# Altium schematic sheet LED_Panel.SchDoc
size D; SheetNumber: 1; SheetTotal: 1
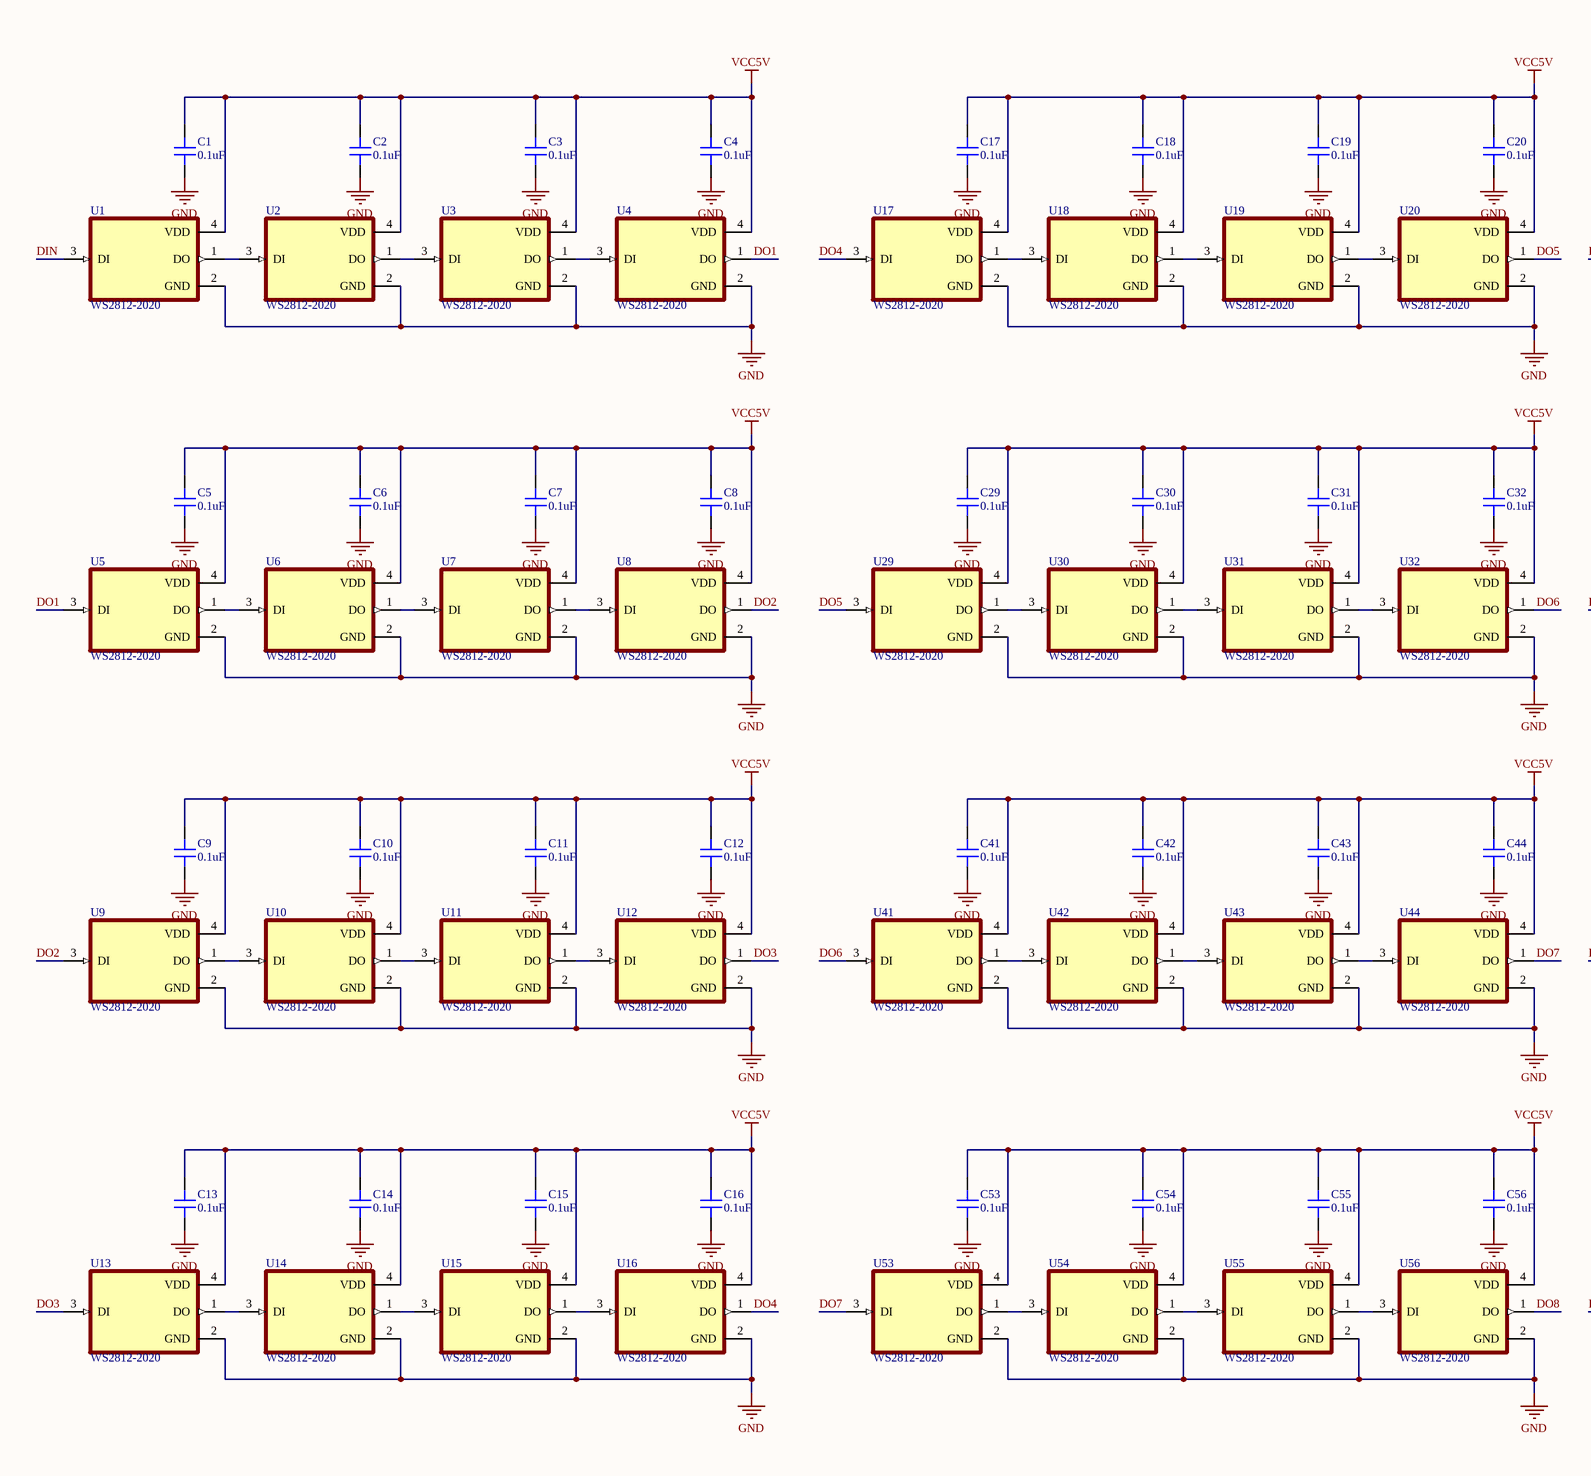
[diagram p0: LED_Panel.SchDoc, left]
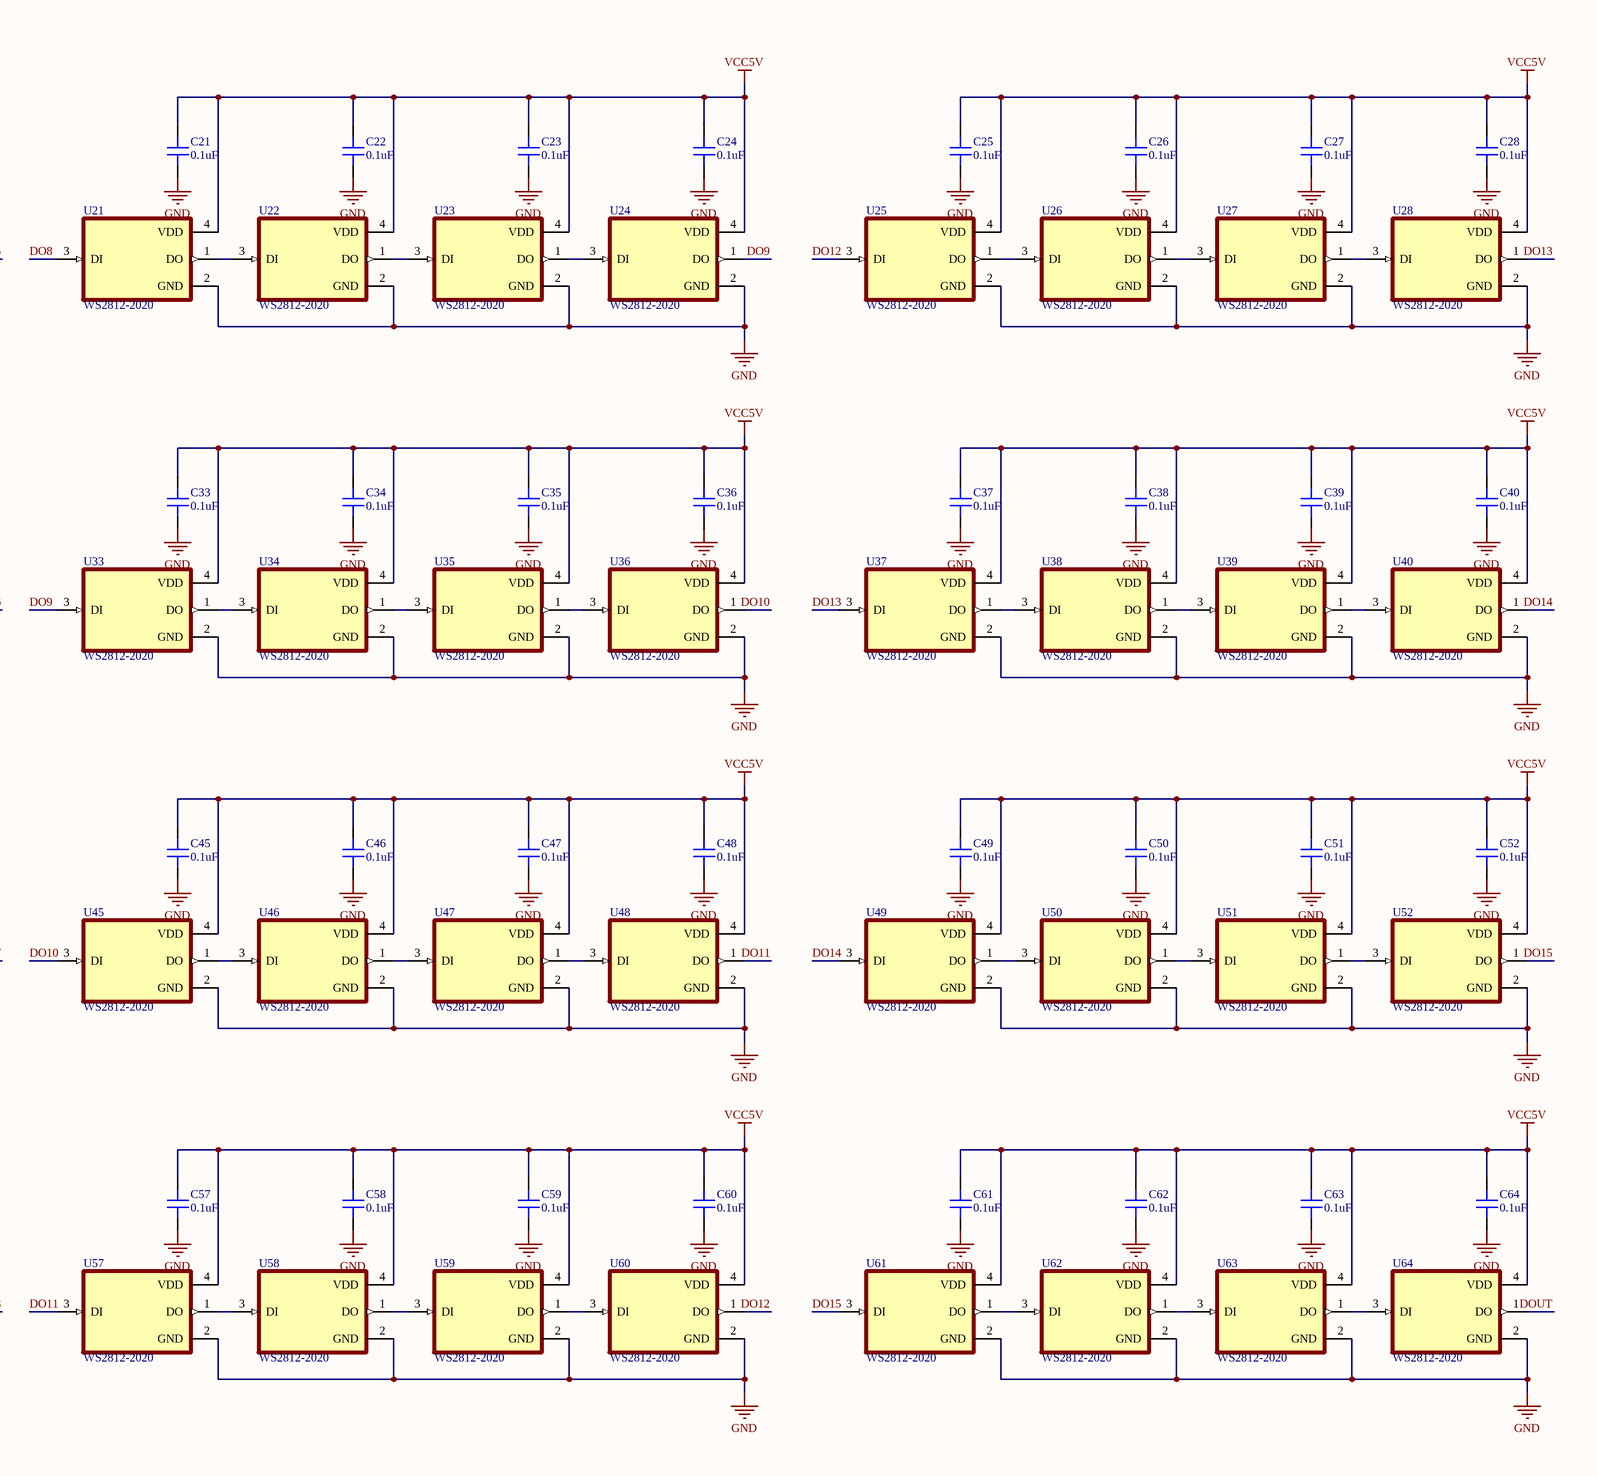
[diagram p1: LED_Panel.SchDoc, right]

## Parts
C1  0.1uF  [CAP 0603_1608]
C2  0.1uF  [CAP 0603_1608]
C3  0.1uF  [CAP 0603_1608]
C4  0.1uF  [CAP 0603_1608]
C5  0.1uF  [CAP 0603_1608]
C6  0.1uF  [CAP 0603_1608]
C7  0.1uF  [CAP 0603_1608]
C8  0.1uF  [CAP 0603_1608]
C9  0.1uF  [CAP 0603_1608]
C10  0.1uF  [CAP 0603_1608]
C11  0.1uF  [CAP 0603_1608]
C12  0.1uF  [CAP 0603_1608]
C13  0.1uF  [CAP 0603_1608]
C14  0.1uF  [CAP 0603_1608]
C15  0.1uF  [CAP 0603_1608]
C16  0.1uF  [CAP 0603_1608]
C17  0.1uF  [CAP 0603_1608]
C18  0.1uF  [CAP 0603_1608]
C19  0.1uF  [CAP 0603_1608]
C20  0.1uF  [CAP 0603_1608]
C21  0.1uF  [CAP 0603_1608]
C22  0.1uF  [CAP 0603_1608]
C23  0.1uF  [CAP 0603_1608]
C24  0.1uF  [CAP 0603_1608]
C25  0.1uF  [CAP 0603_1608]
C26  0.1uF  [CAP 0603_1608]
C27  0.1uF  [CAP 0603_1608]
C28  0.1uF  [CAP 0603_1608]
C29  0.1uF  [CAP 0603_1608]
C30  0.1uF  [CAP 0603_1608]
C31  0.1uF  [CAP 0603_1608]
C32  0.1uF  [CAP 0603_1608]
C33  0.1uF  [CAP 0603_1608]
C34  0.1uF  [CAP 0603_1608]
C35  0.1uF  [CAP 0603_1608]
C36  0.1uF  [CAP 0603_1608]
C37  0.1uF  [CAP 0603_1608]
C38  0.1uF  [CAP 0603_1608]
C39  0.1uF  [CAP 0603_1608]
C40  0.1uF  [CAP 0603_1608]
C41  0.1uF  [CAP 0603_1608]
C42  0.1uF  [CAP 0603_1608]
C43  0.1uF  [CAP 0603_1608]
C44  0.1uF  [CAP 0603_1608]
C45  0.1uF  [CAP 0603_1608]
C46  0.1uF  [CAP 0603_1608]
C47  0.1uF  [CAP 0603_1608]
C48  0.1uF  [CAP 0603_1608]
C49  0.1uF  [CAP 0603_1608]
C50  0.1uF  [CAP 0603_1608]
C51  0.1uF  [CAP 0603_1608]
C52  0.1uF  [CAP 0603_1608]
C53  0.1uF  [CAP 0603_1608]
C54  0.1uF  [CAP 0603_1608]
C55  0.1uF  [CAP 0603_1608]
C56  0.1uF  [CAP 0603_1608]
C57  0.1uF  [CAP 0603_1608]
C58  0.1uF  [CAP 0603_1608]
C59  0.1uF  [CAP 0603_1608]
C60  0.1uF  [CAP 0603_1608]
C61  0.1uF  [CAP 0603_1608]
C62  0.1uF  [CAP 0603_1608]
C63  0.1uF  [CAP 0603_1608]
C64  0.1uF  [CAP 0603_1608]
U1  WS2812-2020  [LED_WS2812-2020]
U2  WS2812-2020  [LED_WS2812-2020]
U3  WS2812-2020  [LED_WS2812-2020]
U4  WS2812-2020  [LED_WS2812-2020]
U5  WS2812-2020  [LED_WS2812-2020]
U6  WS2812-2020  [LED_WS2812-2020]
U7  WS2812-2020  [LED_WS2812-2020]
U8  WS2812-2020  [LED_WS2812-2020]
U9  WS2812-2020  [LED_WS2812-2020]
U10  WS2812-2020  [LED_WS2812-2020]
U11  WS2812-2020  [LED_WS2812-2020]
U12  WS2812-2020  [LED_WS2812-2020]
U13  WS2812-2020  [LED_WS2812-2020]
U14  WS2812-2020  [LED_WS2812-2020]
U15  WS2812-2020  [LED_WS2812-2020]
U16  WS2812-2020  [LED_WS2812-2020]
U17  WS2812-2020  [LED_WS2812-2020]
U18  WS2812-2020  [LED_WS2812-2020]
U19  WS2812-2020  [LED_WS2812-2020]
U20  WS2812-2020  [LED_WS2812-2020]
U21  WS2812-2020  [LED_WS2812-2020]
U22  WS2812-2020  [LED_WS2812-2020]
U23  WS2812-2020  [LED_WS2812-2020]
U24  WS2812-2020  [LED_WS2812-2020]
U25  WS2812-2020  [LED_WS2812-2020]
U26  WS2812-2020  [LED_WS2812-2020]
U27  WS2812-2020  [LED_WS2812-2020]
U28  WS2812-2020  [LED_WS2812-2020]
U29  WS2812-2020  [LED_WS2812-2020]
U30  WS2812-2020  [LED_WS2812-2020]
U31  WS2812-2020  [LED_WS2812-2020]
U32  WS2812-2020  [LED_WS2812-2020]
U33  WS2812-2020  [LED_WS2812-2020]
U34  WS2812-2020  [LED_WS2812-2020]
U35  WS2812-2020  [LED_WS2812-2020]
U36  WS2812-2020  [LED_WS2812-2020]
U37  WS2812-2020  [LED_WS2812-2020]
U38  WS2812-2020  [LED_WS2812-2020]
U39  WS2812-2020  [LED_WS2812-2020]
U40  WS2812-2020  [LED_WS2812-2020]
U41  WS2812-2020  [LED_WS2812-2020]
U42  WS2812-2020  [LED_WS2812-2020]
U43  WS2812-2020  [LED_WS2812-2020]
U44  WS2812-2020  [LED_WS2812-2020]
U45  WS2812-2020  [LED_WS2812-2020]
U46  WS2812-2020  [LED_WS2812-2020]
U47  WS2812-2020  [LED_WS2812-2020]
U48  WS2812-2020  [LED_WS2812-2020]
U49  WS2812-2020  [LED_WS2812-2020]
U50  WS2812-2020  [LED_WS2812-2020]
U51  WS2812-2020  [LED_WS2812-2020]
U52  WS2812-2020  [LED_WS2812-2020]
U53  WS2812-2020  [LED_WS2812-2020]
U54  WS2812-2020  [LED_WS2812-2020]
U55  WS2812-2020  [LED_WS2812-2020]
U56  WS2812-2020  [LED_WS2812-2020]
U57  WS2812-2020  [LED_WS2812-2020]
U58  WS2812-2020  [LED_WS2812-2020]
U59  WS2812-2020  [LED_WS2812-2020]
U60  WS2812-2020  [LED_WS2812-2020]
U61  WS2812-2020  [LED_WS2812-2020]
U62  WS2812-2020  [LED_WS2812-2020]
U63  WS2812-2020  [LED_WS2812-2020]
U64  WS2812-2020  [LED_WS2812-2020]

## Nets
GND: C1.1 C2.1 C3.1 C4.1 C5.1 C6.1 C7.1 C8.1 C9.1 C10.1 C11.1 C12.1 C13.1 C14.1 C15.1 C16.1 C17.1 C18.1 C19.1 C20.1 C21.1 C22.1 C23.1 C24.1 C25.1 C26.1 C27.1 C28.1 C29.1 C30.1 C31.1 C32.1 C33.1 C34.1 C35.1 C36.1 C37.1 C38.1 C39.1 C40.1 C41.1 C42.1 C43.1 C44.1 C45.1 C46.1 C47.1 C48.1 C49.1 C50.1 C51.1 C52.1 C53.1 C54.1 C55.1 C56.1 C57.1 C58.1 C59.1 C60.1 C61.1 C62.1 C63.1 C64.1 U1.2(GND) U2.2(GND) U3.2(GND) U4.2(GND) U5.2(GND) U6.2(GND) U7.2(GND) U8.2(GND) U9.2(GND) U10.2(GND) U11.2(GND) U12.2(GND) U13.2(GND) U14.2(GND) U15.2(GND) U16.2(GND) U17.2(GND) U18.2(GND) U19.2(GND) U20.2(GND) U21.2(GND) U22.2(GND) U23.2(GND) U24.2(GND) U25.2(GND) U26.2(GND) U27.2(GND) U28.2(GND) U29.2(GND) U30.2(GND) U31.2(GND) U32.2(GND) U33.2(GND) U34.2(GND) U35.2(GND) U36.2(GND) U37.2(GND) U38.2(GND) U39.2(GND) U40.2(GND) U41.2(GND) U42.2(GND) U43.2(GND) U44.2(GND) U45.2(GND) U46.2(GND) U47.2(GND) U48.2(GND) U49.2(GND) U50.2(GND) U51.2(GND) U52.2(GND) U53.2(GND) U54.2(GND) U55.2(GND) U56.2(GND) U57.2(GND) U58.2(GND) U59.2(GND) U60.2(GND) U61.2(GND) U62.2(GND) U63.2(GND) U64.2(GND)
VCC5V: C1.2 C2.2 C3.2 C4.2 C5.2 C6.2 C7.2 C8.2 C9.2 C10.2 C11.2 C12.2 C13.2 C14.2 C15.2 C16.2 C17.2 C18.2 C19.2 C20.2 C21.2 C22.2 C23.2 C24.2 C25.2 C26.2 C27.2 C28.2 C29.2 C30.2 C31.2 C32.2 C33.2 C34.2 C35.2 C36.2 C37.2 C38.2 C39.2 C40.2 C41.2 C42.2 C43.2 C44.2 C45.2 C46.2 C47.2 C48.2 C49.2 C50.2 C51.2 C52.2 C53.2 C54.2 C55.2 C56.2 C57.2 C58.2 C59.2 C60.2 C61.2 C62.2 C63.2 C64.2 U1.4(VDD) U2.4(VDD) U3.4(VDD) U4.4(VDD) U5.4(VDD) U6.4(VDD) U7.4(VDD) U8.4(VDD) U9.4(VDD) U10.4(VDD) U11.4(VDD) U12.4(VDD) U13.4(VDD) U14.4(VDD) U15.4(VDD) U16.4(VDD) U17.4(VDD) U18.4(VDD) U19.4(VDD) U20.4(VDD) U21.4(VDD) U22.4(VDD) U23.4(VDD) U24.4(VDD) U25.4(VDD) U26.4(VDD) U27.4(VDD) U28.4(VDD) U29.4(VDD) U30.4(VDD) U31.4(VDD) U32.4(VDD) U33.4(VDD) U34.4(VDD) U35.4(VDD) U36.4(VDD) U37.4(VDD) U38.4(VDD) U39.4(VDD) U40.4(VDD) U41.4(VDD) U42.4(VDD) U43.4(VDD) U44.4(VDD) U45.4(VDD) U46.4(VDD) U47.4(VDD) U48.4(VDD) U49.4(VDD) U50.4(VDD) U51.4(VDD) U52.4(VDD) U53.4(VDD) U54.4(VDD) U55.4(VDD) U56.4(VDD) U57.4(VDD) U58.4(VDD) U59.4(VDD) U60.4(VDD) U61.4(VDD) U62.4(VDD) U63.4(VDD) U64.4(VDD)
DIN: U1.3(DI)
DO1: U4.1(DO) U5.3(DI)
DO2: U8.1(DO) U9.3(DI)
DO3: U12.1(DO) U13.3(DI)
DO4: U16.1(DO) U17.3(DI)
DO5: U20.1(DO) U29.3(DI)
DO6: U32.1(DO) U41.3(DI)
DO7: U44.1(DO) U53.3(DI)
DO8: U21.3(DI) U56.1(DO)
DO9: U24.1(DO) U33.3(DI)
DO10: U36.1(DO) U45.3(DI)
DO11: U48.1(DO) U57.3(DI)
DO12: U25.3(DI) U60.1(DO)
DO13: U28.1(DO) U37.3(DI)
DO14: U40.1(DO) U49.3(DI)
DO15: U52.1(DO) U61.3(DI)
DOUT: U64.1(DO)
NetU1_1: U1.1(DO) U2.3(DI)
NetU2_1: U2.1(DO) U3.3(DI)
NetU3_1: U3.1(DO) U4.3(DI)
NetU5_1: U5.1(DO) U6.3(DI)
NetU6_1: U6.1(DO) U7.3(DI)
NetU7_1: U7.1(DO) U8.3(DI)
NetU9_1: U9.1(DO) U10.3(DI)
NetU10_1: U10.1(DO) U11.3(DI)
NetU11_1: U11.1(DO) U12.3(DI)
NetU13_1: U13.1(DO) U14.3(DI)
NetU14_1: U14.1(DO) U15.3(DI)
NetU15_1: U15.1(DO) U16.3(DI)
NetU17_1: U17.1(DO) U18.3(DI)
NetU18_1: U18.1(DO) U19.3(DI)
NetU19_1: U19.1(DO) U20.3(DI)
NetU21_1: U21.1(DO) U22.3(DI)
NetU22_1: U22.1(DO) U23.3(DI)
NetU23_1: U23.1(DO) U24.3(DI)
NetU25_1: U25.1(DO) U26.3(DI)
NetU26_1: U26.1(DO) U27.3(DI)
NetU27_1: U27.1(DO) U28.3(DI)
NetU29_1: U29.1(DO) U30.3(DI)
NetU30_1: U30.1(DO) U31.3(DI)
NetU31_1: U31.1(DO) U32.3(DI)
NetU33_1: U33.1(DO) U34.3(DI)
NetU34_1: U34.1(DO) U35.3(DI)
NetU35_1: U35.1(DO) U36.3(DI)
NetU37_1: U37.1(DO) U38.3(DI)
NetU38_1: U38.1(DO) U39.3(DI)
NetU39_1: U39.1(DO) U40.3(DI)
NetU41_1: U41.1(DO) U42.3(DI)
NetU42_1: U42.1(DO) U43.3(DI)
NetU43_1: U43.1(DO) U44.3(DI)
NetU45_1: U45.1(DO) U46.3(DI)
NetU46_1: U46.1(DO) U47.3(DI)
NetU47_1: U47.1(DO) U48.3(DI)
NetU49_1: U49.1(DO) U50.3(DI)
NetU50_1: U50.1(DO) U51.3(DI)
NetU51_1: U51.1(DO) U52.3(DI)
NetU53_1: U53.1(DO) U54.3(DI)
NetU54_1: U54.1(DO) U55.3(DI)
NetU55_1: U55.1(DO) U56.3(DI)
NetU57_1: U57.1(DO) U58.3(DI)
NetU58_1: U58.1(DO) U59.3(DI)
NetU59_1: U59.1(DO) U60.3(DI)
NetU61_1: U61.1(DO) U62.3(DI)
NetU62_1: U62.1(DO) U63.3(DI)
NetU63_1: U63.1(DO) U64.3(DI)

## Library data of the parts
C1-C64 = C0603C272F3GAC7867: CAP CER 2700PF 25V NP0 0603; manufacturer: KEMET; Temperature Coefficient: C0G, NP0; Tolerance: ±1%; Part Number: C0603C272F3GAC7867; Value: 0.1uF; Applications: General Purpose; Capacitance: 2700 pF; componentlink1description: Datasheet; componentlink1url: https://api.kemet.com/component-edge/download/datasheet/C0603C272F3GACTU.pdf; componentlink2description: DigiKey Link; componentlink2url: https://www.digikey.com/en/products/detail/kemet/C0603C272F3GAC7867/2200413; Device Package: 0603 (1608 Metric); Features: Low ESL; lastupdated: 2022/5/23 下午 12:55:07; Lifecycle Status: Active; Minimum Order: 1; Mounting Type: Surface Mount, MLCC; Operating Temperature: -55°C ~ 125°C; Package / Case: 0603 (1608 Metric); packaging: TapeAndReel; partid: 2138; Part Status: Active; price: 0.46; series: SMD Comm C0G; Size / Dimension: 0.063" L x 0.031" W (1.60mm x 0.80mm); Supplier 1: DigiKey; Supplier Part Number 1: 399-17403-1-ND; Thickness (Max): 0.034" (0.87mm); Voltage - Rated: 25V
U1-U64 = WS2812-2020: MF: {'manufacturer': u'Worldsemi'}; Package: None; Price: None; Value: *; MP: WS2812-2020; Availability: Unavailable